# Altium schematic sheet M5_Display_GPIO.SchDoc
size A4
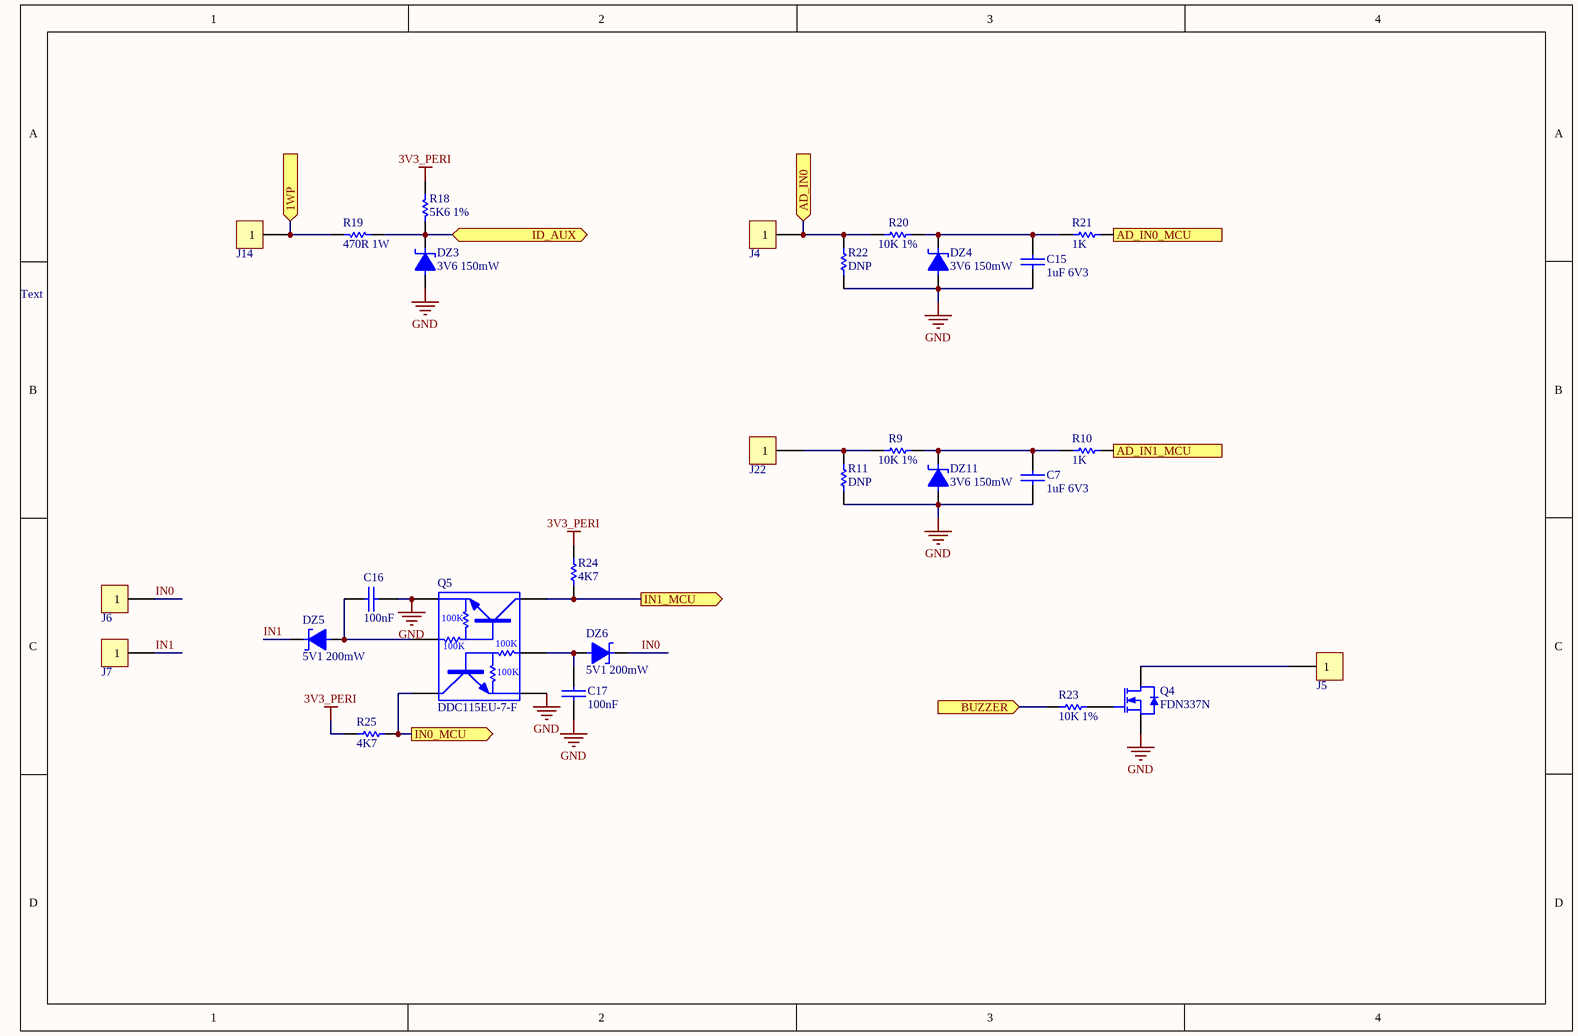
[diagram p0: M5_Display_GPIO.SchDoc]

## Parts
C7  1uF 6V3  [0402]
C15  1uF 6V3  [0402]
C16  100nF  [0402]
C17  100nF  [0402]
DZ3  3V6 150mW  [SOD523]
DZ4  3V6 150mW  [SOD523]
DZ5  5V1 200mW  [SOD523]
DZ6  5V1 200mW  [SOD523]
DZ11  3V6 150mW  [SOD523]
J4  PIN CABLE  [PIN_CABLE]  (value not drawn)  (no BOM)
J5  PIN CABLE  [PIN_CABLE]  (value not drawn)  (no BOM)
J6  PIN CABLE  [PIN_CABLE]  (value not drawn)  (no BOM)
J7  PIN CABLE  [PIN_CABLE]  (value not drawn)  (no BOM)
J14  PIN CABLE  [PIN_CABLE]  (value not drawn)  (no BOM)
J22  PIN CABLE  [PIN_CABLE]  (value not drawn)  (no BOM)
Q4  FDN337N  [SOT23]
Q5  DDC115EU-7-F  [SOT363]
R9  10K 1%  [0402]
R10  1K  [0402]
R11  DNP  [0805]  (no BOM)
R18  5K6 1%  [0402]
R19  470R 1W  [2010]
R20  10K 1%  [0402]
R21  1K  [0402]
R22  DNP  [0805]  (no BOM)
R23  10K 1%  [0402]
R24  4K7  [0402]
R25  4K7  [0402]

## Ports
1WP (in), AD_IN0 (in), AD_IN0_MCU (out), AD_IN1_MCU (out), BUZZER (in), ID_AUX (bidir), IN0_MCU (out), IN1_MCU (out)

## Nets
3V3_PERI: R18.2 R24.1 R25.1
GND: C7.2 C15.2 C16.2 C17.2 DZ3.1 DZ4.1 DZ11.1 Q4.3(S) Q5.1(EQ1) Q5.4(EQ2) R11.1 R22.1
1WP: J14.1 R19.2 ; port 1WP
AD_IN0: J4.1 R20.1 R22.2 ; port AD_IN0
AD_IN0_MCU: R21.1 ; port AD_IN0_MCU
AD_IN1_MCU: R10.1 ; port AD_IN1_MCU
BUZZER: R23.2 ; port BUZZER
ID_AUX: DZ3.2 R18.1 R19.1 ; port ID_AUX
IN0: DZ6.2 J6.1
IN0_MCU: Q5.3(CQ2) R25.2 ; port IN0_MCU
IN1: DZ5.2 J7.1
IN1_MCU: Q5.6(CQ1) R24.2 ; port IN1_MCU
NetC7_1: C7.1 DZ11.2 R9.2 R10.2
NetC15_1: C15.1 DZ4.2 R20.2 R21.2
NetC16_1: C16.1 DZ5.1 Q5.2(BQ1)
NetC17_1: C17.1 DZ6.1 Q5.5(BQ2)
NetJ5_1: J5.1 Q4.2(D)
NetJ22_1: J22.1 R9.1 R11.2
NetQ4_1: Q4.1(G) R23.1

## Notes on the sheet
- Text
- (in symbol DDC115EU-7-F_SOT363) 100K

## Library data of the parts
C7 C15 = CAP0402_1uF_6V3_X7R: CAP0402 1uF 6V3 X7R; Manufacturer: Samsung Electro-Mechanics; Manufacturer Part Number: CL05B105KQ5NQNC; CREO: EB; Part Number: CAP0402_1uF_6V3_X7R; Value: 1uF 6V3; Supplier 1: Digi-Key; Supplier Part Number 1: 1276-1513-2-ND
C16 C17 = CAP0402_100nF_50V_X7R: CAP0402 100nF 50V X7R; Manufacturer: TDK Corporation; Manufacturer Part Number: C1005X7R1H104K050BB; CREO: LL; Precio: 0; Part Number: CAP0402_100nF_50V_X7R; Value: 100nF; Digikey PN: 445-5932-2-ND; Supplier 1: Digi-Key; Supplier Part Number 1: 445-5932-2-ND
DZ3 DZ4 DZ11 = DIO_ZEN_3V6_SOD523: DIODE ZENER 3.6V 150MW SSMINI2 SOD523; Manufacturer: Panasonic Electronic Components; Manufacturer Part Number: DZ2S036M0L; CREO: EB; Part Number: DIO_ZEN_3V6_SOD523; Value: 3V6 150mW; Supplier 1: Digi-Key; Supplier Part Number 1: DZ2S036M0LCT-ND
DZ5 DZ6 = DIO_ZEN_5V1_200mW_SOD523: DIODE ZENER 5.1V 200MW SOD523F; Manufacturer: MM5Z5V1; Manufacturer Part Number: Fairchild Semiconductor; CREO: JS; Part Number: DIO_ZEN_5V1_200mW_SOD523; Value: 5V1 200mW; Supplier 1: Digi-Key; Supplier Part Number 1: MM5Z5V1CT-ND
J4-J7 J14 J22 = PIN_1_CABLE_1mm: PIN PARA SOLDAR CABLE 1MM; Publico: EB; Part Number: PIN_1_CABLE_1mm; Value: PIN CABLE; Aprobo: -
Q4 = FDN337N_SOT23: MOSFET N-CH 30V 2.2A SSOT3; Publico: EB; Part Number: FDN337N_SOT23; Value: FDN337N; Supplier 1: Digi-Key; Supplier Part Number 1: FDN337NCT-ND; Aprobo: -
Q5 = DDC115EU-7-F_SOT363: TRANS BRT NPN DUAL 50V SOT-363 Rb=100K Rbe=100K; Manufacturer: Diodes Incorporated; Publico: EB; Precio: 0; Part Number: DDC115EU-7-F_SOT363; Value: DDC115EU-7-F; Digikey PN: DDC115EU-7-FDICT-ND; Aprobo: -; Manufacturer #: DDC115EU-7-F; Manufacturer Part Number: DDC115EU-7-F; Supplier 1: Digi-Key; Supplier Part Number 1: DDC115EU-7-FDICT-ND
R9 R20 = RES0402_10K_1%: RES0402 10K 1%; Publico: EB; Part Number: RES0402_10K_1%; Value: 10K 1%; Supplier 1: Digi-Key; Supplier Part Number 1: RMCF0402FT10K0TR-ND; Aprobo: -
R10 R21 = RES0402_1K_5%: RES0402 1K 5%; Publico: EB; Part Number: RES0402_1K_5%; Value: 1K; Supplier 1: Digi-Key; Supplier Part Number 1: RMCF0402JT1K00CT-ND; Aprobo: -
R11 R22 = RES0805_DNP: RES0805 DNP; Publico: EB; Part Number: RES0805_DNP; Value: DNP; Aprobo: -
R18 = RES0402_5K6_1%: RES0402 5K6 1%; Manufacturer: Stackpole Electronics Inc; Manufacturer Part Number: RMCF0402FT5K60; Publico: EB; Precio: 0; Part Number: RES0402_5K6_1%; Value: 5K6 1%; Digikey PN: RMCF0402FT5K60CT-ND; Aprobo: -; Supplier 1: Digi-Key; Supplier Part Number 1: RMCF0402FT5K60CT-ND
R19 = RES2010_470R_1W_5%: RES2010 470R 1W 5%; Manufacturer: Stackpole Electronics Inc; Publico: EB; Precio: 0; Part Number: RES2010_470R_1W_5%; Value: 470R 1W; Digikey PN: RMCP2010FT470RCT-ND; Aprobo: -; Supplier 1: Digi-Key; Supplier Part Number 1: RMCP2010FT470RCT-ND
R23 = RES0402_10K_1%: RES0402 10K 1%; Publico: EB; Precio: 0; Part Number: RES0402_10K_1%; Value: 10K 1%; Digikey PN: RMCF0402FT10K0TR-ND; Aprobo: -; Supplier 1: Digi-Key; Supplier Part Number 1: RMCF0402FT10K0TR-ND
R24 R25 = RES0402_4K7_5%: RES0402 4K7 5%; Manufacturer: Stackpole Electronics Inc; Manufacturer Part Number: RMCF0402JT4K70; Publico: EB; Precio: 0; Part Number: RES0402_4K7_5%; Value: 4K7; Digikey PN: RMCF0402JT4K70CT-ND; Aprobo: -; Supplier 1: Digi-Key; Supplier Part Number 1: RMCF0402JT4K70CT-ND